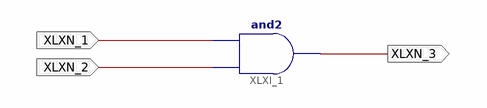
[diagram p0: schematic sheet 1]
// Xilinx ISE schematic test.sch (spartan3) as structural Verilog: 1 symbols, 3 ports
module test (
  input  XLXN_1,
  input  XLXN_2,
  output XLXN_3
);

  and XLXI_1 (XLXN_3, XLXN_2, XLXN_1);
endmodule
